# EasyEDA Pro project 通信+控制电路板.epro, board PCB2
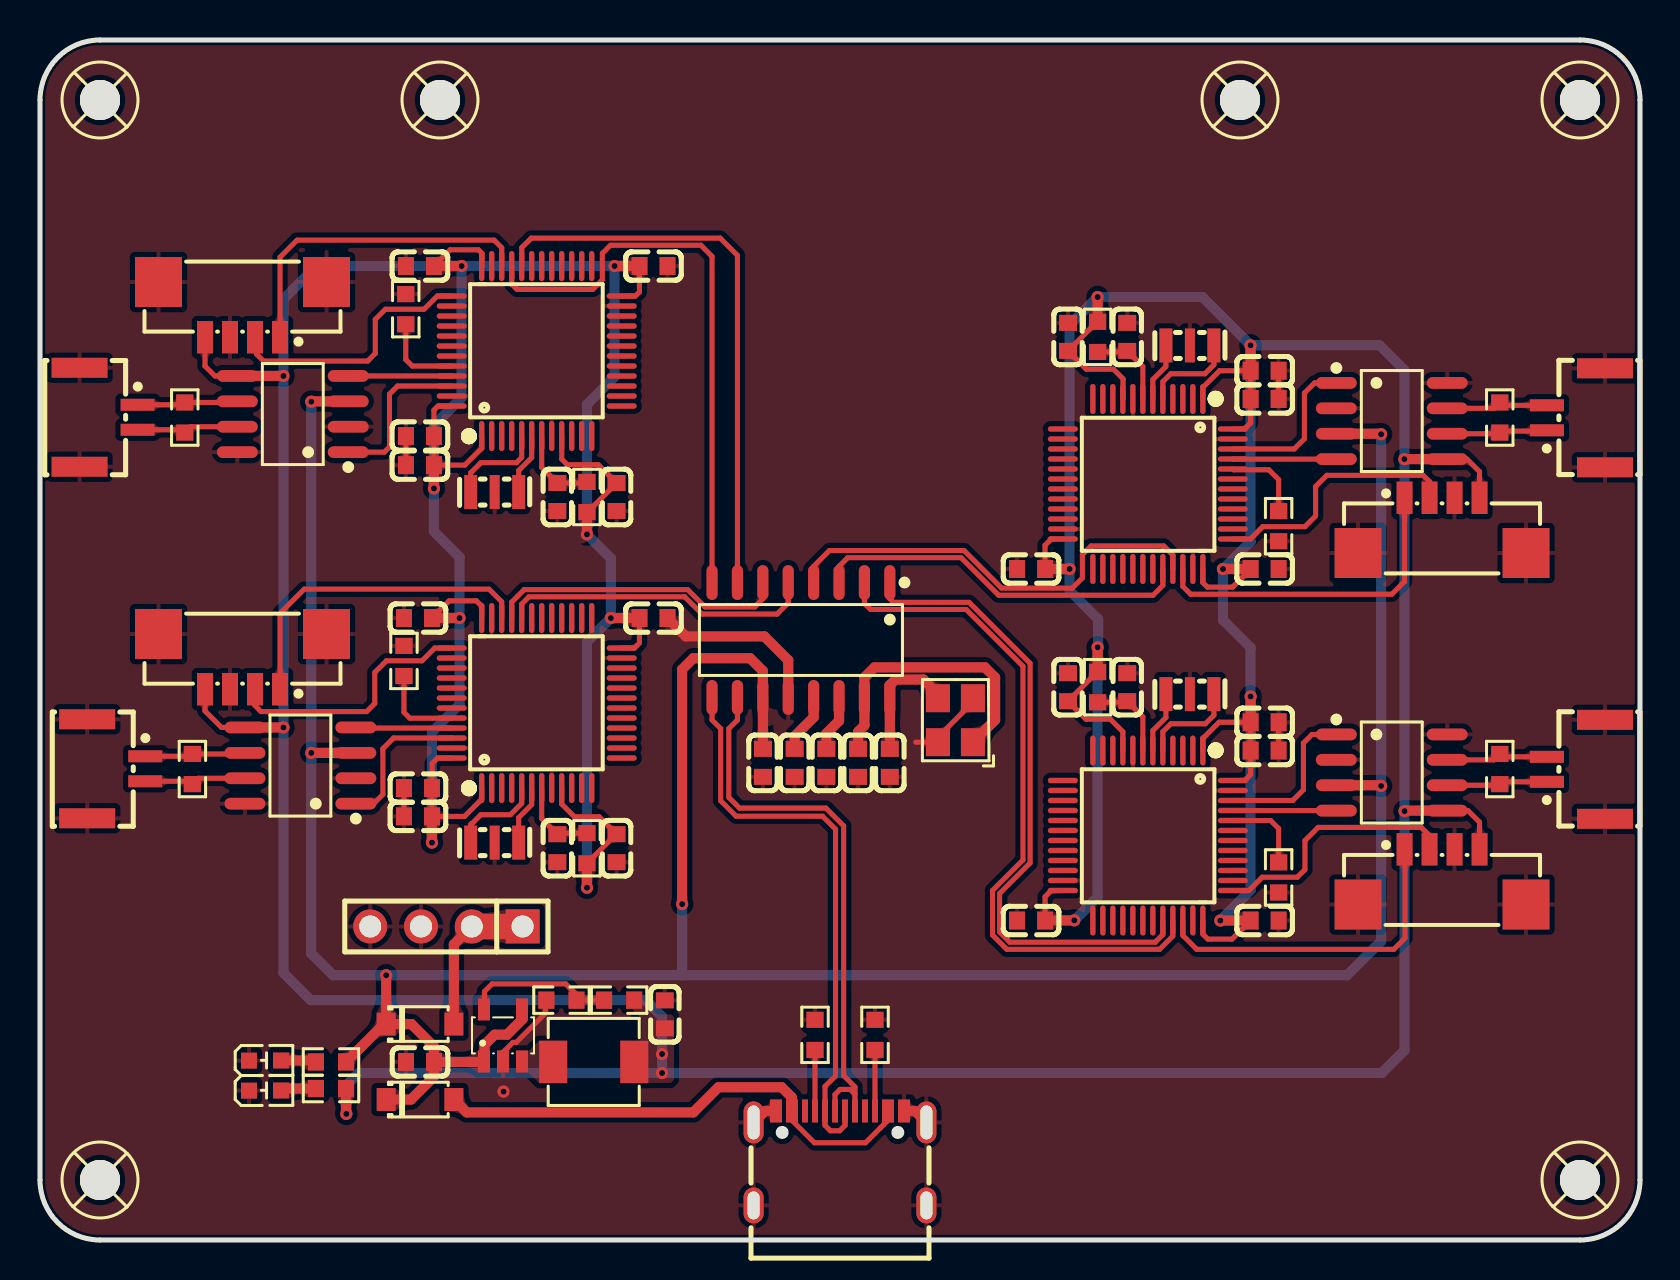
[diagram p4: board, top side]
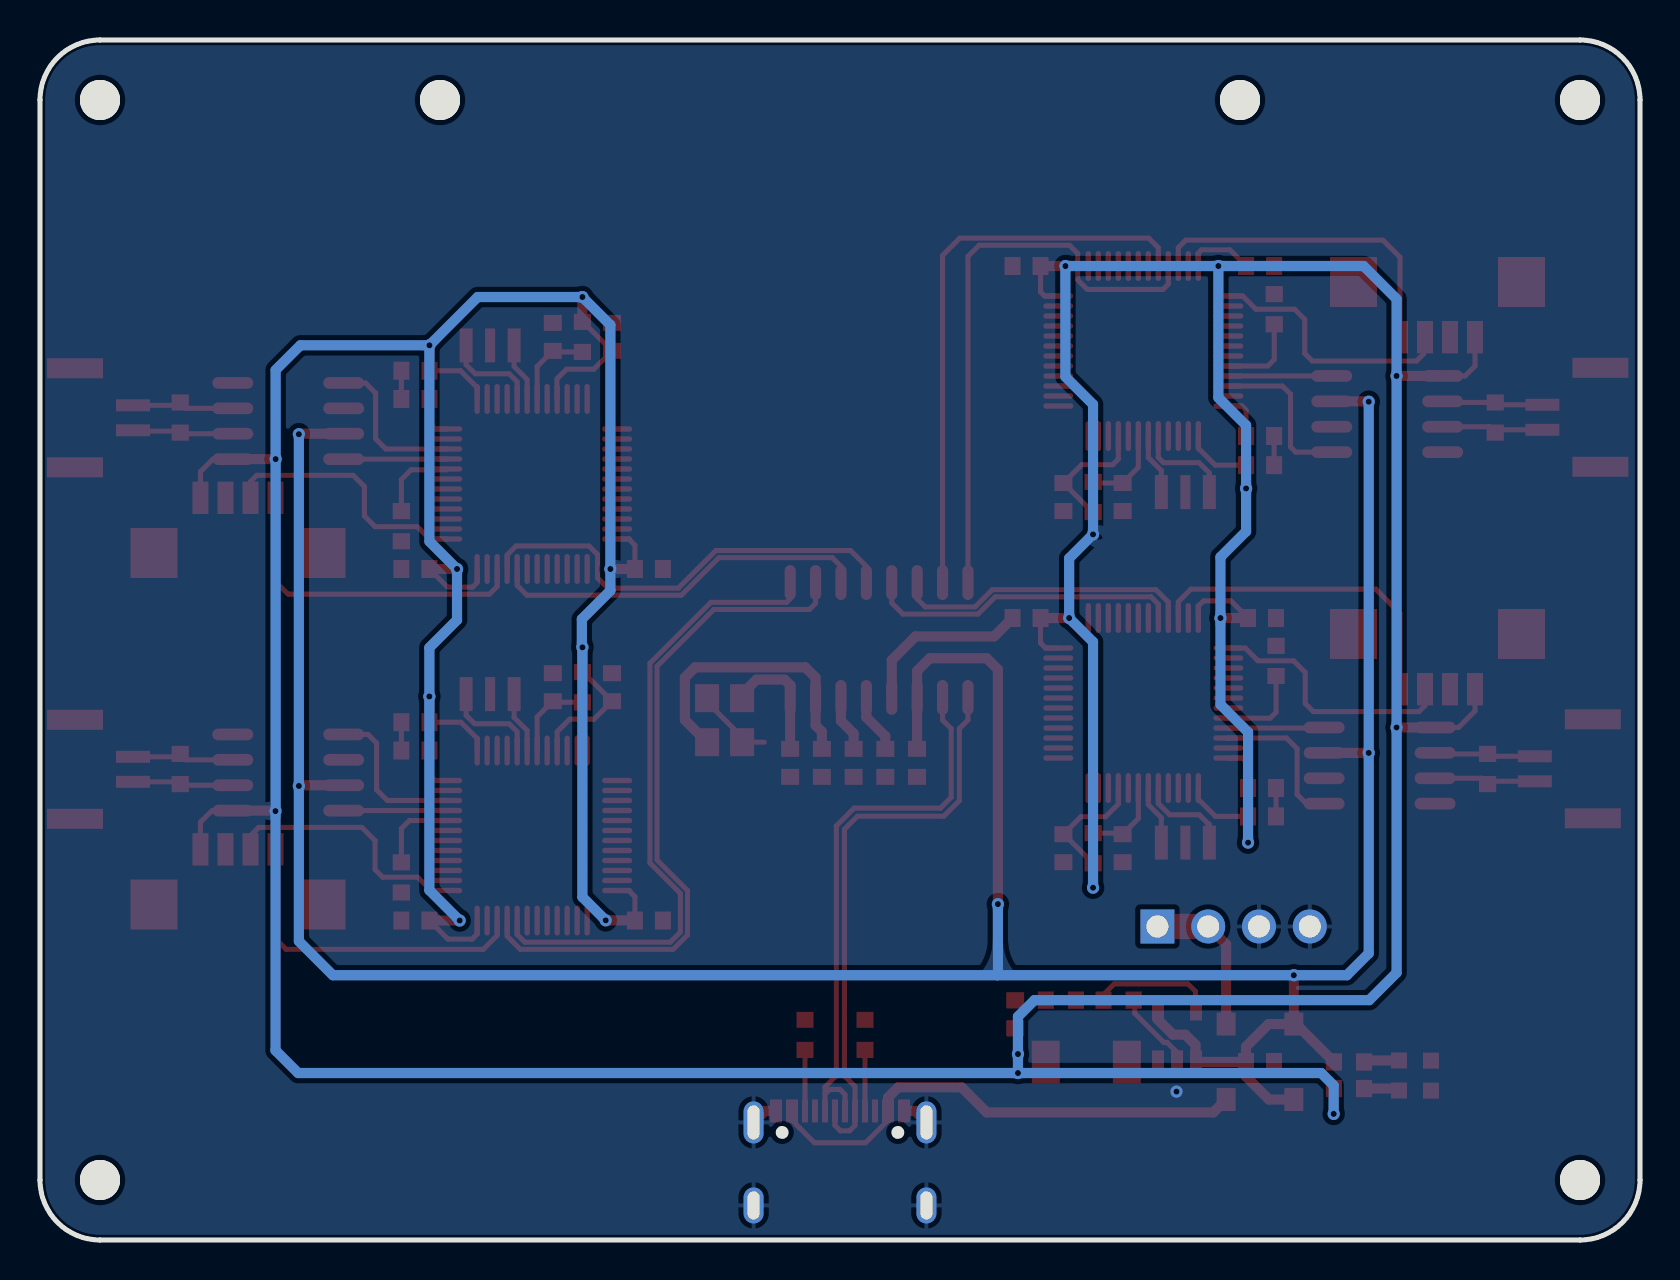
[diagram p5: board, bottom side, seen from below]

Outline 80 x 60 mm; copper layers: Top Layer, Bottom Layer. Coordinates in mm from the lower left corner of the outline.
Outline path: 0,57 0,3 arc(0.88,0.88) 3,0 77,0 arc(79.12,0.88) 80,3 80,57 arc(79.12,59.12) 77,60 3,60 arc(0.88,59.12) 0,57
Stack: Top Layer 0.035mm / Dielectric1 1.51mm FR4 er 4.5 / Bottom Layer 0.035mm

## Design rules (mm)
template: JLCPCB Capability(Two Layers Board)
spacing copperThickness1oz (default): track to track 0.102, other pairs 0.152 to 0.3
spacing copperThickness2oz: track to track 0.203, other pairs 0.152 to 0.3
track width copperThickness1oz (default): min 0.127, default 0.254, max 2.54
track width copperThickness2oz: min 0.203, default 0.254, max 2.54
differential pair differentialPair (default): width min 0.127, default 0.254, max 2.54; gap min 0.152, default 0.152
via viaSize (default): diameter min 0.5, default 0.61, max 10; hole min 0.3, default 0.305, max 6.3

## Placement (name value [footprint] x y rotation side)
C1  10uF  [C0603]  39.32 23.86 270 top
C2  10uF  [C0603]  37.73 23.86 270 top
C3  10uF  [C0603]  36.15 23.86 270 top
C4  20pF  [C0603]  42.49 23.86 270 top
C5  20pF  [C0603]  40.91 23.86 270 top
C6  4.7uF  [C0603]  19 8.9 0 top
C31  10uF  [C0603]  31.24 11.28 270 top
C32  100nF  [C0603]  25.87 19.59 90 top
C33  100nF  [C0603]  30.67 31.1 180 top
C34  100nF  [C0603]  28.83 19.59 90 top
C35  100nF  [C0603]  18.9 21.18 0 top
C36  100nF  [C0603]  18.9 22.6 0 top
C37  100nF  [C0603]  18.9 31.1 0 top
C38  100nF  [C0603]  25.87 37.15 90 top
C39  100nF  [C0603]  19 48.7 0 top
C40  100nF  [C0603]  30.67 48.7 180 top
C41  100nF  [C0603]  19 40.2 0 top
C42  100nF  [C0603]  28.83 37.15 90 top
C43  100nF  [C0603]  19 38.74 0 top
C44  100nF  [C0603]  54.36 45.16 270 top
C45  100nF  [C0603]  51.4 45.16 270 top
C46  100nF  [C0603]  61.23 33.55 180 top
C47  100nF  [C0603]  49.55 33.55 0 top
C48  100nF  [C0603]  61.23 43.46 180 top
C49  100nF  [C0603]  61.23 42.05 180 top
C50  100nF  [C0603]  54.36 27.64 270 top
C51  100nF  [C0603]  49.55 15.97 0 top
C52  100nF  [C0603]  61.23 25.89 180 top
C53  100nF  [C0603]  51.4 27.64 270 top
C54  100nF  [C0603]  61.23 15.97 180 top
C55  100nF  [C0603]  61.23 24.47 180 top
CN2  HC-1.25-4PLT  [CONN-SMD_4P-P1.25_HCTL_HC-1.25-4PLT]  10.13 46.52 180 top
CN5  WAFER-GH1.25-2PWB  [CONN-TH_2P-P1.25_XUNPU_WAFER-GH1.25-2PWB]  3.43 41.14 270 top
CN6  WAFER-GH1.25-2PWB  [CONN-TH_2P-P1.25_XUNPU_WAFER-GH1.25-2PWB]  3.81 23.56 270 top
CN7  HC-1.25-4PLT  [CONN-SMD_4P-P1.25_HCTL_HC-1.25-4PLT]  10.13 28.92 180 top
CN8  WAFER-GH1.25-2PWB  [CONN-TH_2P-P1.25_XUNPU_WAFER-GH1.25-2PWB]  76.8 41.11 90 top
CN9  HC-1.25-4PLT  [CONN-SMD_4P-P1.25_HCTL_HC-1.25-4PLT]  70.1 35.73 0 top
CN10  WAFER-GH1.25-2PWB  [CONN-TH_2P-P1.25_XUNPU_WAFER-GH1.25-2PWB]  76.8 23.53 90 top
CN11  HC-1.25-4PLT  [CONN-SMD_4P-P1.25_HCTL_HC-1.25-4PLT]  70.1 18.15 0 top
D1  DSS24  [SOD-123_L2.8-W1.8-LS3.7-RD]  19 10.8 0 top
D2  DSS24  [SOD-123_L2.8-W1.8-LS3.7-RD]  19 7.02 0 top
H1  PZ254V-11-04P  [HDR-TH_4P-P2.54-V-M]  20.32 15.68 180 top
L1  2.2uH  [IND-SMD_L4.4-W4.2]  27.69 8.9 180 top
LED1  NCD0603G1  [LED0603-RD_1]  11.25 7.47 0 top
LED2  NCD0603G1  [LED0603-RD_1]  11.25 8.97 0 top
R1  5.1kΩ  [R0603]  38.75 10.26 270 top
R2  5.1kΩ  [R0603]  41.75 10.26 270 top
R51  1kΩ  [R0603]  27.35 37.15 270 top
R54  1kΩ  [R0603]  14.55 7.57 0 top
R69  120Ω  [R0603]  7.24 41.12 270 top
R71  1kΩ  [R0603]  27.35 19.59 270 top
R72  120Ω  [R0603]  7.62 23.55 270 top
R74  1kΩ  [R0603]  52.88 45.16 90 top
R75  120Ω  [R0603]  72.99 41.12 90 top
R77  1kΩ  [R0603]  52.88 27.64 90 top
R78  120Ω  [R0603]  72.99 23.55 90 top
R79  442kΩ  [R0603]  28.96 11.99 0 top
R80  100kΩ  [R0603]  26.07 11.99 0 top
R81  1kΩ  [R0603]  14.55 8.9 0 top
R82  1kΩ  [R0603]  18.29 46.54 90 top
R83  1kΩ  [R0603]  18.2 28.95 90 top
R84  1kΩ  [R0603]  61.93 18.13 270 top
R85  1kΩ  [R0603]  61.93 35.69 270 top
SCREW1  -  [M2螺丝]  20 57 0 top
SCREW2  -  [M2螺丝]  60 57 0 top
SCREW3  -  [M2螺丝]  3 57 0 top
SCREW4  -  [M2螺丝]  77 57 0 top
SCREW5  -  [M2螺丝]  3 3 0 top
SCREW6  -  [M2螺丝]  77 3 0 top
TYPE-C1  TYPE-C16PIN  [TYPE-C 16P 插件]  40 4.09 0 top
U1  SL2.1A  [SOP-16_L10.0-W3.9-P1.27-LS6.0-BL]  38.05 30 180 top
U4  STM32F072C8T6  [LQFP-48_L7.0-W7.0-P0.50-LS9.0-BL]  24.84 44.45 0 top
U20  SIT1042AQT/3  [SOIC-8_L4.9-W3.9-P1.27-LS6.0-BL]  12.64 41.3 90 top
U21  STM32F072C8T6  [LQFP-48_L7.0-W7.0-P0.50-LS9.0-BL]  24.84 26.85 0 top
U22  SIT1042AQT/3  [SOIC-8_L4.9-W3.9-P1.27-LS6.0-BL]  13.02 23.72 90 top
U23  STM32F072C8T6  [LQFP-48_L7.0-W7.0-P0.50-LS9.0-BL]  55.39 37.8 180 top
U24  SIT1042AQT/3  [SOIC-8_L4.9-W3.9-P1.27-LS6.0-BL]  67.59 40.95 270 top
U25  STM32F072C8T6  [LQFP-48_L7.0-W7.0-P0.50-LS9.0-BL]  55.39 20.22 180 top
U26  SIT1042AQT/3  [SOIC-8_L4.9-W3.9-P1.27-LS6.0-BL]  67.59 23.37 270 top
U27  TLV62569DBVR  [SOT-23-5_L3.0-W1.7-P0.95-LS2.8-BR]  23.15 10.23 270 top
X1  8MHz  [OSC-SMD_3P-L3.2-W1.3-P1.2-L]  22.73 37.4 0 top
X2  8MHz  [OSC-SMD_3P-L3.2-W1.3-P1.2-L]  22.73 19.87 0 top
X3  8MHz  [OSC-SMD_3P-L3.2-W1.3-P1.2-L]  57.5 44.73 180 top
X4  8MHz  [OSC-SMD_3P-L3.2-W1.3-P1.2-L]  57.5 27.3 180 top
Y1  12MHz  [3225 贴片晶振_1]  45.77 25.99 90 top

## Footprints (pads in the part's own frame, mm; a bottom-side part is the same pattern mirrored in y, then rotated)
3225 贴片晶振_1
  rect 1.4x1.2 smd: 1(-1.1,-0.875) 2(1.1,-0.875) 3(1.1,0.875) 4(-1.1,0.875)
C0603
  rect 0.8x0.9 smd: 1(-0.7,0) 2(0.7,0)
CONN-SMD_4P-P1.25_HCTL_HC-1.25-4PLT
  rect 0.8x1.62 smd: 1(-1.875,1.38) 2(-0.625,1.38) 3(0.625,1.38) 4(1.875,1.38)
  rect 2.35x2.5 smd: 5(-4.2,-1.38) 6(4.2,-1.38)
CONN-TH_2P-P1.25_XUNPU_WAFER-GH1.25-2PWB
  rect 0.6x1.7 smd: 1(-0.625,1.45) 2(0.625,1.45)
  rect 1x2.8 smd: 3(-2.475,-1.45) 4(2.475,-1.45)
HDR-TH_4P-P2.54-V-M
  rect 1.7x1.7 hole 1.1: 1(-3.81,0)
  round 1.7 hole 1.1: 2(-1.27,0) 3(1.27,0) 4(3.81,0)
IND-SMD_L4.4-W4.2
  rect 1.4x2.12 smd: 1(2.028,0) 2(-2.028,0)
LED0603-RD_1
  rect 0.8x0.8 smd: 1(-0.799,-0.004) 2(0.799,0.004)
LQFP-48_L7.0-W7.0-P0.50-LS9.0-BL
  oval 0.27x1.5 smd: 1(-2.75,-4.25) 2(-2.25,-4.25) 3(-1.75,-4.25) 4(-1.25,-4.25) 5(-0.75,-4.25) 6(-0.25,-4.25) 7(0.25,-4.25) 8(0.75,-4.25) 9(1.25,-4.25) 10(1.75,-4.25) 11(2.25,-4.25) 12(2.75,-4.25) 25(2.75,4.25) 26(2.25,4.25) 27(1.75,4.25) 28(1.25,4.25) 29(0.75,4.25) 30(0.25,4.25) 31(-0.25,4.25) 32(-0.75,4.25) 33(-1.25,4.25) 34(-1.75,4.25) 35(-2.25,4.25) 36(-2.75,4.25)
  oval 1.5x0.27 smd: 13(4.25,-2.75) 14(4.25,-2.25) 15(4.25,-1.75) 16(4.25,-1.25) 17(4.25,-0.75) 18(4.25,-0.25) 19(4.25,0.25) 20(4.25,0.75) 21(4.25,1.25) 22(4.25,1.75) 23(4.25,2.25) 24(4.25,2.75) 37(-4.25,2.75) 38(-4.25,2.25) 39(-4.25,1.75) 40(-4.25,1.25) 41(-4.25,0.75) 42(-4.25,0.25) 43(-4.25,-0.25) 44(-4.25,-0.75) 45(-4.25,-1.25) 46(-4.25,-1.75) 47(-4.25,-2.25) 48(-4.25,-2.75)
M2螺丝
  round 2 hole 2: 1(0,0)
OSC-SMD_3P-L3.2-W1.3-P1.2-L
  rect 0.65x1.7 smd: 1(-1.2,0) 3(1.2,0)
  rect 0.5x1.7 smd: 2(0,0)
R0603
  rect 0.806x0.864 smd: 1(-0.753,0) 2(0.753,0)
SOD-123_L2.8-W1.8-LS3.7-RD
  rect 0.95x1.15 smd: 1(-1.692,0) 2(1.692,0)
SOIC-8_L4.9-W3.9-P1.27-LS6.0-BL
  oval 0.588x2.045 smd: 1(-1.905,-2.772) 2(-0.635,-2.772) 3(0.635,-2.772) 4(1.905,-2.772) 5(1.905,2.772) 6(0.635,2.772) 7(-0.635,2.772) 8(-1.905,2.772)
SOP-16_L10.0-W3.9-P1.27-LS6.0-BL
  oval 0.56x1.745 smd: 1(-4.445,-2.873) 2(-3.175,-2.873) 3(-1.905,-2.873) 4(-0.635,-2.873) 5(0.635,-2.873) 6(1.905,-2.873) 7(3.175,-2.873) 8(4.445,-2.873) 9(4.445,2.873) 10(3.175,2.873) 11(1.905,2.873) 12(0.635,2.873) 13(-0.635,2.873) 14(-1.905,2.873) 15(-3.175,2.873) 16(-4.445,2.873)
SOT-23-5_L3.0-W1.7-P0.95-LS2.8-BR
  rect 1.1x0.6 smd: 1(1.3,-0.95) 2(1.3,0) 3(1.3,0.95) 4(-1.3,0.95) 5(-1.3,-0.95)
TYPE-C 16P 插件
  oval 1.001x2.1 hole 0.6x1.7: 1(-4.321,1.788) 2(4.321,1.788)
  oval 1.001x1.801 hole 0.6x1.399: 3(-4.321,-2.362) 4(4.321,-2.362)
  rect 0.6x1.151 smd: A1B12(-3.2,2.362) A4B9(-2.401,2.362) B1A12(3.2,2.362) B4A9(2.401,2.362)
  rect 0.299x1.151 smd: A5(-1.25,2.362) A6(-0.249,2.362) A7(0.249,2.362) A8(-1.75,2.362) B5(1.75,2.362) B6(0.75,2.362) B7(-0.75,2.362) B8(1.25,2.362)

## Nets
As in the schematic.

Pads without a net: SCREW1 1; SCREW2 1; SCREW3 1; SCREW4 1; SCREW5 1; SCREW6 1; TYPE-C1 A8 B8; U4 2 3 4 10 11 12 13 14 15 16 17 18 19 20 21 22 25 26 27 28 29 30 31 38 39 40 41 42 43; U21 2 3 4 10 11 12 13 14 15 16 17 18 19 20 21 22 25 26 27 28 29 30 31 38 39 40 41 42 43; U23 2 3 4 10 11 12 13 14 15 16 17 18 19 20 21 22 25 26 27 28 29 30 31 38 39 40 41 42 43; U25 2 3 4 10 11 12 13 14 15 16 17 18 19 20 21 22 25 26 27 28 29 30 31 38 39 40 41 42 43

## Via types
v1: diameter 0.61, hole 0.305, Top Layer to Bottom Layer, 30 vias

## Routing (per net, layer and track width the routed paths; a pad name or vN(x,y) marks a point on that pad's centre or on a via; arc(x,y) is an arc through that point)
3V3: length 426.3
  Top Layer w0.254: U21.36 22.09,31.69 21.82,31.96 20.46,31.96 C37.2 ; R71.2 28.8,20.29 C34.2 27.96,21.16 26.72,21.16 26.09,21.8 U21.9 ; U4.24 29.77,47.2 29.97,47.4 29.97,48.7 ; U4.36 22.1,48.71 22.1,49.33 21.92,49.51 20.51,49.51 C39.2 ; 60.51,15.95 59.6,15.04 58.39,15.04 58.14,15.29 U25.36 ; R74.2 52.85,45.91 C45.2 52.31,43.54 53.67,43.54 54.15,43.06 54.15,42.06 U23.9 ; C47.2 50.25,34.74 50.56,35.05 U23.24 ; C51.2 50.25,17.16 50.56,17.47 U25.24 ; U22.5 9.07,25.63 8.25,26.45 CN7.4 ; 71.98,37.11 71.98,38.42 71.35,39.04 70.36,39.04 ; U23.36 58.14,32.87 58.37,32.64 59.63,32.64 C46.2 ; U25.48 60.23,22.97 60.53,23.28 C55.2 C52.2 58.95,25.89 58.14,25.08 U25.1 ; U21.1 22.09,22.04 21.23,21.18 C35.2 C36.2 19.61,22.61 19.61,23.83 19.88,24.1 U21.48 ; R77.2 52.85,28.39 C53.2 52.3,26.04 53.52,26.04 54.14,25.42 U25.9 ; U4.1 22.09,39.59 21.24,38.74 C43.2 C41.2 19.7,41.49 19.9,41.7 U4.48 ; C33.2 29.97,29.85 29.72,29.6 U21.24 ; R51.2 27.38,36.4 C42.2 27.91,38.77 26.37,38.77 26.09,39.05 U4.9 ; CN2.4 8.25,43.7 8.75,43.2 U20.5 ; U23.48 60.23,40.55 60.53,40.85 C49.2 C48.2 58.98,43.46 58.14,42.63 U23.1 ; 71.98,19.53 71.98,20.89 71.4,21.47 U26.5
  Top Layer w0.508: C43.2 v1(19.7,37.58) ; C35.2 v1(19.6,19.87) ; 29.9,48.75 29.85,48.7 v1(28.73,48.7) ; v1(59.15,33.55) C46.2 ; v1(15.32,6.3) 15.3,6.32 R54.2 ; v1(27.35,35.28) R51.2 ; C37.2 v1(20.98,31.1) ; 70.36,21.47 68.25,21.47 v1(68.23,21.44) ; R74.2 v1(52.88,47.15) ; v1(51.71,15.98) 50.26,15.98 C51.2 ; v1(28.54,31.1) C33.2 ; v1(21.08,48.7) C39.2 ; v1(12.17,25.63) U22.5 ; v1(60.53,44.73) 60.53,44.73 C48.2 ; U20.5 v1(12.17,43.2) ; v1(68.22,39.04) 70.36,39.04 ; 60.45,16.01 60.42,15.97 v1(59.02,15.97) ; v1(60.53,27.18) C52.2 ; R71.2 v1(27.35,17.61) ; C47.2 v1(51.48,33.55) ; R77.2 v1(52.88,29.63)
  Bottom Layer w0.508: v1(19.6,19.87) 19.6,25.39 20.98,26.77 v1(20.98,31.1) 20.98,34.15 19.7,35.43 v1(19.7,37.58) 19.7,40.73 21.08,42.12 v1(21.08,48.7) ; v1(21.08,48.7) 13.82,48.7 12.17,47.05 v1(12.17,43.2) v1(12.17,25.63) 12.17,13.36 13.54,11.99 30.28,11.99 31.1,11.17 v1(31.1,9.3) v1(31.1,8.35) ; v1(21.08,48.7) v1(28.73,48.7) 28.73,43.16 27.35,41.78 v1(27.35,35.28) 28.54,34.09 v1(28.54,31.1) 27.35,29.9 v1(27.35,17.61) ; v1(60.53,44.73) 66.98,44.73 68.22,43.5 v1(68.22,39.04) 68.22,21.45 v1(68.23,21.44) 68.22,21.44 68.22,9.48 67.09,8.35 v1(31.1,8.35) ; v1(60.53,44.73) 58.12,47.15 v1(52.88,47.15) 51.48,45.75 v1(51.48,33.55) 51.48,32.47 52.91,31.04 52.91,29.66 v1(52.88,29.63) 52.88,17.15 v1(51.71,15.98) ; v1(60.53,44.73) 60.53,34.93 v1(59.15,33.55) 59.15,31 60.53,29.62 v1(60.53,27.18) 60.53,17.49 v1(59.02,15.97) ; v1(31.1,8.35) 15.94,8.35 15.32,7.73 v1(15.32,6.3)
5V: length 158.6
  Top Layer w0.508: R81.2 17.2,10.8 D1.1 ; D1.1 18.57,10.8 19.7,9.67 C6.2 ; D1.1 v1(17.31,13.24) ; C6.2 22.22,8.9 22.22,9.76 22.73,10.27 23.35,10.27 24.12,11.04 24.12,11.5 ; C6.2 19.7,8.17 18.55,7.02 D2.1 ; U20.3 13.58,41.93 v1(13.56,41.92) ; v1(67.06,40.29) 67.03,40.31 U24.3 ; C3.1 36.15,27.12 U1.11 36.14,28.46 35.51,29.09 32.66,29.09 32.11,28.53 v1(32.11,16.79) ; U22.3 15.79,24.36 v1(13.56,24.36) ; U26.3 67.02,22.74 v1(67.06,22.7)
  Bottom Layer w0.508: 32.14,13.24 v1(17.31,13.24) 14.66,13.24 13.56,14.33 v1(13.56,24.36) v1(13.56,41.92) ; 32.14,13.24 32.11,13.27 v1(32.11,16.79) ; 32.14,13.24 65.35,13.24 67.06,14.94 v1(67.06,22.7) v1(67.06,40.29)
5V-C: length 25.2
  Top Layer w0.254: TYPE-C1.B4A9 42.4,5.99 42.18,5.77 42.18,5.76 42.02,5.6 42.01,5.6 41.28,4.86 38.72,4.86 37.6,5.98 TYPE-C1.A4B9
  Top Layer w0.508: TYPE-C1.A4B9 37.59,6.46 37.59,7.13 37.08,7.64 33.92,7.64 32.66,6.38 21.34,6.38 D2.2
5V-DC: length 7.8
  Top Layer w0.508: H1.2 20.69,14.78 D1.2
  Top Layer w1.27: H1.2 H1.1
GND: length 25.3
  Top Layer w0.254: C52.1 C55.1 ; C41.1 C43.1 ; C49.1 C48.1 ; 43.79,24.89 Y1.4 44.9,25.14 46.52,26.77 46.52,26.96 Y1.2 ; R80.1 25.27,11.94 25.27,11.34 23.81,9.88 23.65,9.88 23.18,9.41 23.18,8.9 ; C36.1 C35.1
  Top Layer w0.508: TYPE-C1.1 36.25,6.45 TYPE-C1.A1B12 ; TYPE-C1.B1A12 43.75,6.45 TYPE-C1.2 ; U1.12 37.41,28.99 36.22,30.18 32.29,30.18 C33.1
  vias: v1(23.18,7.42)
CAN_RX1: length 5.2
  Top Layer w0.254: U20.4 20.58,43.2 U4.45
CAN_RX2: length 4.8
  Top Layer w0.254: U22.4 15.82,25.6 U21.45
CAN_RX3: length 5.2
  Top Layer w0.254: U24.4 59.65,39.04 U23.45
CAN_RX4: length 5.2
  Top Layer w0.254: U26.4 64.81,21.47 U25.45
CAN_TX1: length 8.1
  Top Layer w0.254: U20.1 17.21,39.39 17.47,39.65 17.47,42.3 17.88,42.7 U4.46
CAN_TX2: length 7.5
  Top Layer w0.254: U22.1 16.68,21.82 17.14,22.28 17.14,24.57 17.68,25.1 20.58,25.1 U21.46
CAN_TX3: length 7.9
  Top Layer w0.254: U23.46 59.65,39.55 62.71,39.55 63.22,40.06 63.22,42.35 63.73,42.85 U24.1
CAN_TX4: length 7.9
  Top Layer w0.254: U26.1 63.6,25.28 63.17,24.85 63.17,22.51 62.64,21.98 59.65,21.98 U25.46
CC1: length 3.1
  Top Layer w0.254: TYPE-C1.A5 38.75,9.5
CC2: length 3.1
  Top Layer w0.254: TYPE-C1.B5 41.75,9.5
D+1: length 29.3
  Top Layer w0.254: U1.8 33.6,49.18 33.05,49.74 28.52,49.74 28.12,49.33 28.12,48.01 27.63,47.53 23.85,47.53 23.59,47.79 U4.33
D+2: length 15
  Top Layer w0.254: U21.33 23.59,31.9 24.21,32.52 32.38,32.52 33.25,31.65 35.74,31.65 36.14,32.06 U1.6
D+3: length 22.3
  Top Layer w0.254: U23.33 56.64,34.25 56.19,34.7 52.55,34.7 52.12,34.27 52.12,33.1 51.61,32.59 48.08,32.59 46.2,34.47 39.47,34.47 38.68,33.68 U1.4
D+4: length 34.7
  Top Layer w0.254: U25.33 56.64,15.19 55.98,14.53 48.34,14.53 47.62,15.25 47.62,17.48 49.15,19 49.15,28.69 46.31,31.53 41.53,31.53 41.22,31.83 U1.2
D-1: length 28.6
  Top Layer w0.254: U1.7 34.87,49.23 34.01,50.09 24.56,50.09 24.09,49.62 U4.32
D-2: length 15.8
  Top Layer w0.254: U21.32 24.08,31.1 24.08,31.79 24.45,32.16 32.24,32.16 33.1,31.3 36.85,31.3 37.41,31.85 U1.5
D-3: length 19
  Top Layer w0.254: U1.3 39.95,33.68 40.39,34.12 46.05,34.12 47.93,32.24 55.65,32.24 56.14,32.73 U23.32
D-4: length 32.5
  Top Layer w0.254: U1.1 42.49,32.06 42.67,31.88 46.46,31.88 49.5,28.83 49.5,18.85 47.98,17.33 47.98,15.4 48.49,14.89 55.76,14.89 56.14,15.27 U25.32
IND+: length 28
  Top Layer w0.254: TYPE-C1.A6 39.75,7.27 40,7.53 40.51,7.53 40.75,7.29 ; U1.10 34.87,26 34.44,25.57 34.44,22.13 34.98,21.59 39.29,21.59 40.18,20.71 40.18,8.22 40.75,7.65 40.75,7.29 ; 40.75,7.29 TYPE-C1.B6
IND-: length 28.7
  Top Layer w0.254: TYPE-C1.A7 40.26,6.44 40.26,5.74 39.98,5.46 39.52,5.46 39.25,5.73 TYPE-C1.B7 39.25,7.68 39.78,8.2 39.78,20.54 39.13,21.19 34.81,21.19 34.03,21.96 34.03,25.57 33.6,26 U1.9
NRST1: length 4.2
  Top Layer w0.254: R51.1 27.29,37.85 C38.2 25.09,38.63 U4.7
NRST2: length 4.1
  Top Layer w0.254: U21.7 25.09,21.07 C32.2 25.92,20.34 R71.1
NRST3: length 4.2
  Top Layer w0.254: U23.7 55.14,43.67 C44.2 54.31,44.4 R74.1
NRST4: length 4.3
  Top Layer w0.254: R77.1 54.31,26.89 C50.2 55.14,26.16 U25.7
SWCLK1: length 13.1
  Top Layer w0.254: CN2.2 10.82,45.07 10.82,44.3 11.18,43.95 16.38,43.95 16.76,44.33 16.76,46.03 17.27,46.54 19.2,46.54 19.86,47.2 U4.37
SWCLK2: length 13
  Top Layer w0.254: U21.37 19.74,29.6 19.1,28.96 17.32,28.96 16.74,28.38 16.74,26.83 16.33,26.42 11.05,26.42 10.75,26.72 CN7.2
SWCLK3: length 13
  Top Layer w0.254: CN9.2 69.48,37.92 69.16,38.23 64.34,38.23 63.78,37.67 63.78,36.2 63.25,35.67 61.14,35.67 60.52,35.05 U23.37
SWCLK4: length 12.8
  Top Layer w0.254: CN11.2 69.48,20.22 69.06,20.63 63.91,20.63 63.25,19.97 63.25,18.52 62.87,18.14 61.11,18.14 60.44,17.47 U25.37
SWDIO1: length 16.5
  Top Layer w0.254: CN2.1 12,49.14 12.85,49.99 22.71,49.99 23.09,49.61 U4.34
SWDIO2: length 16.5
  Top Layer w0.254: U21.34 23.09,31.91 22.45,32.54 13.21,32.54 12,31.33 CN7.1
SWDIO3: length 16.6
  Top Layer w0.254: CN9.1 68.23,32.93 67.59,32.29 57.53,32.29 57.14,32.68 U23.34
SWDIO4: length 17.2
  Top Layer w0.254: U25.34 57.14,15.23 57.84,14.53 67.69,14.53 68.25,15.09 68.25,19.87 68.23,19.89
$1N1080: length 6.2
  Top Layer w0.508: Y1.3 44.9,27.3 44.17,28.02 42.77,28.02 42.49,27.74 U1.16 C4.1
$1N1085: length 14.3
  Top Layer w0.508: C5.1 40.91,25.41 41.22,25.73 U1.15 41.22,28.12 41.73,28.63 47.25,28.63 47.76,28.12 47.76,26 Y1.1
$1N1217: length 2.8
  Top Layer w0.508: C1.1 39.32,25.33 39.95,25.96 U1.14
$1N1224: length 3
  Top Layer w0.508: C2.1 37.73,25.19 38.68,26.14 U1.13
$1N3104: length 4.2
  Top Layer w0.254: 18.29,45.79 18.29,44.02 18.61,43.7 U4.44
$1N3112: length 4.9
  Top Layer w0.254: U4.5 24.09,39.13 23.82,38.87 22.05,38.87 21.53,38.35 21.53,37.4
$1N3113: length 3.1
  Top Layer w0.254: U4.6 24.59,39.12 23.93,38.47 X1.3
$1N3290: length 1.8
  Top Layer w0.508: LED1.2 12.15,7.57 13.8,7.57
$1N3925: length 5.2
  Top Layer w0.254: CN5.2 7.1,40.51 R69.2 7.53,40.66 U20.7
$1N3926: length 5.1
  Top Layer w0.254: CN5.1 7.12,41.76 R69.1 9.81,41.88 U20.6
$1N5937: length 4.7
  Top Layer w0.254: U21.5 24.09,21.83 23.52,21.27 22.04,21.27 21.6,20.83 21.58,20.83 21.53,20.78 21.53,19.87
$1N5960: length 5.2
  Top Layer w0.254: CN6.2 7.48,22.94 R72.2 7.91,23.09 U22.7
$1N5961: length 5.1
  Top Layer w0.254: CN6.1 7.5,24.19 R72.1 10.19,24.3 U22.6
$1N5979: length 4.3
  Top Layer w0.254: U21.44 20.58,26.09 18.49,26.09 18.2,26.38 R83.1
$1N5983: length 3
  Top Layer w0.254: X2.3 23.93,21.12 24.59,21.77 U21.6
$1N8697: length 5.2
  Top Layer w0.254: 70.36,24.01 72.7,24.01 R78.2 73.13,24.16 75.35,24.16
$1N8698: length 5.1
  Top Layer w0.254: 70.36,22.74 72.93,22.74 R78.1 73.1,22.91 75.35,22.91
$1N8710: length 4.1
  Top Layer w0.254: U25.44 61.53,20.97 61.93,20.57 R84.1
$1N8713: length 3.1
  Top Layer w0.254: X4.3 56.29,26.12 55.64,25.47 U25.6
$1N8727: length 4.9
  Top Layer w0.254: U25.5 56.14,25.41 56.54,25.81 58.27,25.81 58.69,26.24 58.69,27.3
$1N8737: length 4.7
  Top Layer w0.254: 58.69,44.73 58.69,43.76 58.24,43.31 56.54,43.31 56.14,42.91 U23.5
$1N8756: length 4.1
  Top Layer w0.254: 61.93,36.44 61.93,38.02 61.44,38.51 59.68,38.51 U23.44
$1N8775: length 2.9
  Top Layer w0.254: X3.3 56.29,43.68 55.64,43.02 U23.6
$1N8815: length 5.2
  Top Layer w0.254: 70.36,41.58 72.7,41.58 R75.2 73.13,41.73 75.35,41.73
$1N8816: length 5.1
  Top Layer w0.254: 72.9,40.44 75.31,40.44 75.35,40.48 ; 70.36,40.31 72.93,40.31 R75.1
$1N10079: length 7.6
  Top Layer w0.254: 22.22,11.5 22.22,12.43 22.61,12.81 26.29,12.81 26.82,12.27 R80.2 R79.1
$1N10342: length 1.8
  Top Layer w0.508: 13.8,8.9 13.72,8.98 LED2.2

## Copper pours and planes (outline as drawn; the poured copper is in the pictures)
3V3 on Top Layer: 29.01,12.43 31.7,12.43 31.7,7.85 29.01,7.85
GND on Top Layer: -7.44,62.6 82.68,62.6 82.68,-4.52 -7.44,-4.52
GND on Bottom Layer: -5.23,65.74 85.88,65.74 85.88,-5.94 -5.23,-5.94
$1N9929 on Top Layer: 23.82,9.96 26.36,9.96 26.36,7.85 23.82,7.85

Small or netless copper shapes (teardrops, artwork), in the pictures only: 259 on Top Layer, 54 on Bottom Layer
